# Altium schematic sheet 24进制计数器.SchDoc
size A4
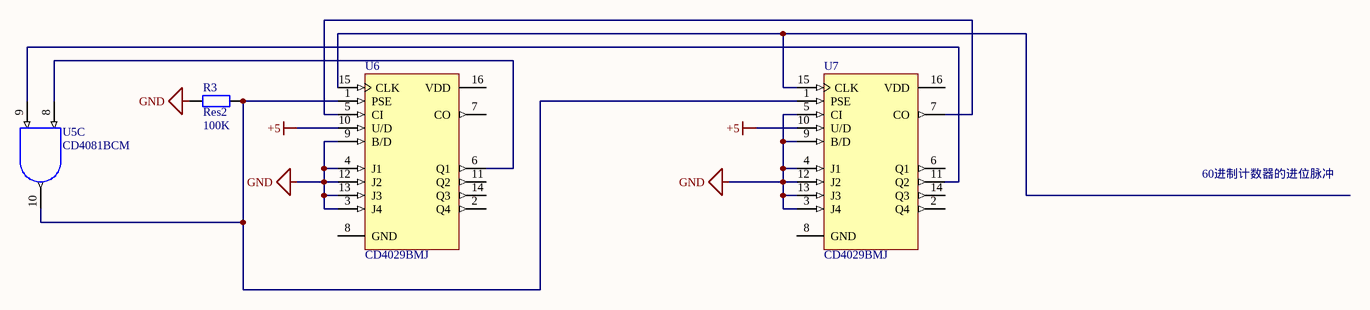
[diagram p0: 24进制计数器.SchDoc]

## Parts
R3  Res2  value 100K  [AXIAL-0.4]
U5  CD4081BCM  [M14A_N]  (part C of 4)
U6  CD4029BMJ  [J16A]
U7  CD4029BMJ  [J16A]

## Nets
+5: U6.10(U/D) U7.10(U/D)
GND: R3.1 U5.7(GND) U6.3(J4) U6.4(J1) U6.9(B/D) U6.12(J2) U6.13(J3) U7.3(J4) U7.4(J1) U7.5(CI) U7.9(B/D) U7.12(J2) U7.13(J3)
VDD: U5.14(VDD)
NetR3_2: R3.2 U5.10(J) U6.1(PSE) U7.1(PSE)
NetU5_8: U5.8(A) U6.6(Q1)
NetU5_9: U5.9(B) U7.11(Q2)
NetU6_5: U6.5(CI) U7.7(CO)
NetU6_15: U6.15(CLK) U7.15(CLK)

Not connected (* = marked no-connect by the designer): U6 2(Q4) 7(CO) 8(GND) 11(Q2) 14(Q3) 16(VDD); U7 2(Q4) 6(Q1) 8(GND) 14(Q3) 16(VDD)

## Notes on the sheet
- 60进制计数器的进位脉冲

## Library data of the parts
R3 = Res2: Resistor; Published: 8-Jun-2000; LatestRevisionDate: 17-Jul-2002; LatestRevisionNote: Re-released for DXP Platform.; PackageReference: AXIAL-0.4; Publisher: Altium Limited; PackageDescription: Axial Device, Thru-Hole; 2 Leads; 0.4 in Pin Spacing
U5 = CD4081BCM: Quad 2-Input AND Buffered B series Gate, 14-Pin SOIC; IC_Technology: C; Published: 17-Jul-2002; LatestRevisionDate: 13-Apr-2006; LatestRevisionNote: IPC-7351 Footprint Added.; DatasheetVersion: Jan-1999; PackageVersion: 2000; PackageReference: M14A; Publisher: Altium Limited; PackageDescription: 14-Pin Small Outline Integrated Circuit 1.27 mm Pitch; Code_IPC: SOIC127P600-14; ComponentLink1Description: Manufacturer Link; ComponentLink1URL: http://www.fairchildsemi.com/; ComponentLink2Description: Datasheet; ComponentLink2URL: http://www.fairchildsemi.com/ds/CD%2FCD4071BC.pdf
U6 U7 = CD4029BMJ: Binary/Decade Up/Down Counter; Published: 15-Apr-2002; LatestRevisionDate: 06-Jun-2005; LatestRevisionNote: Stylized 3D Model Added.; DatasheetVersion: Jan-1999; PackageVersion: 2000; PackageReference: J16A; Publisher: Altium Limited; PackageDescription: DIP; 16 Leads; Row Spacing 7.62 mm; Pitch 2.54 mm; ComponentLink1Description: Manufacturer Link; ComponentLink1URL: http://www.national.com/; ComponentLink2Description: Datasheet; ComponentLink2URL: http://www.national.com/ds.cgi/CD/CD4029BC.pdf; ComponentLink3Description: URL Link1; ComponentLink3URL: http://www.national.com/pf/CD/CD4029BM.html